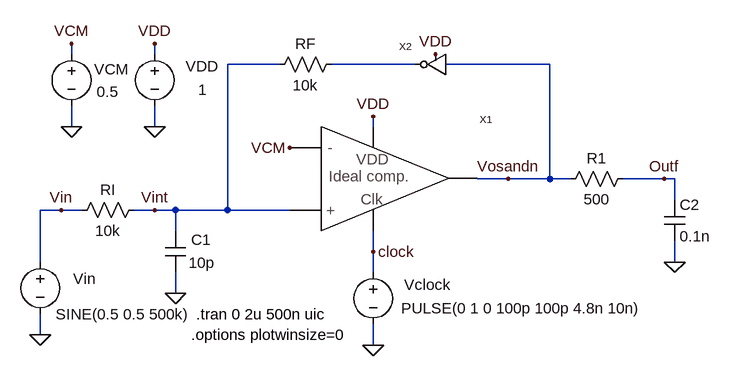
[diagram p0: schematic _Fig6_7_MSD.asc]
_Fig6_7_MSD.asc, the LTspice schematic file:
Version 4
SHEET 1 880 680
WIRE -368 -80 -368 -96
WIRE -240 -80 -240 -96
WIRE -48 -64 -128 -64
WIRE 160 -64 32 -64
WIRE 368 -64 208 -64
WIRE -368 32 -368 0
WIRE -240 32 -240 0
WIRE 96 32 96 16
WIRE 304 112 256 112
WIRE 368 112 368 -64
WIRE 368 112 304 112
WIRE 400 112 368 112
WIRE 544 112 480 112
WIRE 560 112 544 112
WIRE 560 144 560 112
WIRE -384 160 -416 160
WIRE -352 160 -384 160
WIRE -240 160 -272 160
WIRE -208 160 -240 160
WIRE -128 160 -128 -64
WIRE -128 160 -208 160
WIRE -32 160 -128 160
WIRE -208 192 -208 160
WIRE 96 224 96 192
WIRE -416 240 -416 160
WIRE 560 240 560 208
WIRE 96 256 96 224
WIRE -208 288 -208 256
WIRE -416 352 -416 320
WIRE 96 368 96 336
FLAG -240 32 0
FLAG 96 16 VDD
FLAG -240 -96 VDD
FLAG 96 368 0
FLAG 96 224 clock
FLAG -368 32 0
FLAG -368 -96 VCM
FLAG 304 112 Vosandn
FLAG -208 288 0
FLAG -416 352 0
FLAG -384 160 Vin
FLAG -240 160 Vint
FLAG 560 240 0
FLAG 544 112 Outf
FLAG -32 64 VCM
FLAG 192 -80 VDD
SYMBOL Ideal_clocked_comparator 16 112 R0
SYMATTR InstName X1
SYMBOL voltage -240 -96 R0
WINDOW 0 48 35 Left 0
WINDOW 3 67 71 Left 0
SYMATTR InstName VDD
SYMATTR Value 1
SYMBOL voltage 96 240 R0
WINDOW 0 48 35 Left 0
WINDOW 3 43 71 Left 0
WINDOW 123 0 0 Left 0
WINDOW 39 0 0 Left 0
SYMATTR InstName Vclock
SYMATTR Value PULSE(0 1 0 100p 100p 4.8n 10n)
SYMBOL voltage -368 -96 R0
WINDOW 0 35 39 Left 0
WINDOW 3 39 74 Left 0
SYMATTR InstName VCM
SYMATTR Value 0.5
SYMBOL cap -224 192 R0
WINDOW 0 40 14 Left 0
WINDOW 3 36 49 Left 0
SYMATTR InstName C1
SYMATTR Value 10p
SYMBOL res -256 144 R90
WINDOW 0 0 56 VBottom 0
WINDOW 3 32 56 VTop 0
SYMATTR InstName RI
SYMATTR Value 10k
SYMBOL res 48 -80 R90
WINDOW 0 0 56 VBottom 0
WINDOW 3 32 56 VTop 0
SYMATTR InstName RF
SYMATTR Value 10k
SYMBOL voltage -416 224 R0
WINDOW 0 51 42 Left 0
WINDOW 123 0 0 Left 0
WINDOW 39 0 0 Left 0
SYMATTR InstName Vin
SYMATTR Value SINE(0.5 0.5 500k)
SYMBOL res 496 96 R90
WINDOW 0 0 56 VBottom 0
WINDOW 3 32 56 VTop 0
SYMATTR InstName R1
SYMATTR Value 500
SYMBOL cap 544 144 R0
SYMATTR InstName C2
SYMATTR Value 0.1n
SYMBOL inverter 208 -64 M0
SYMATTR InstName X2
TEXT -176 320 Left 0 !.tran 0 2u 500n uic
TEXT -184 352 Left 0 !.options plotwinsize=0

The netlist it stands for:
* _Fig6_7_MSD.asc
XX1 VCM Vint Vosandn VDD clock Ideal_clocked_comparator  ; pins Vinm Vinp Vout VDD Clock
VDD VDD 0 1
Vclock clock 0 PULSE(0 1 0 100p 100p 4.8n 10n)
VCM VCM 0 0.5
C1 Vint 0 10p
RI Vint Vin 10k
RF N001 Vint 10k
Vin Vin 0 SINE(0.5 0.5 500k)
R1 Outf Vosandn 500
C2 Outf 0 0.1n
XX2 Vosandn N001 VDD inverter  ; pins In Out VDD
.tran 0 2u 500n uic
.options plotwinsize=0
.backanno
.end